# Altium project MS1-SEQ.PrjPcb (part 3 of 3)

## Sheet SensorSheet.SchDoc
size A; SheetNumber: 3; SheetTotal: 6
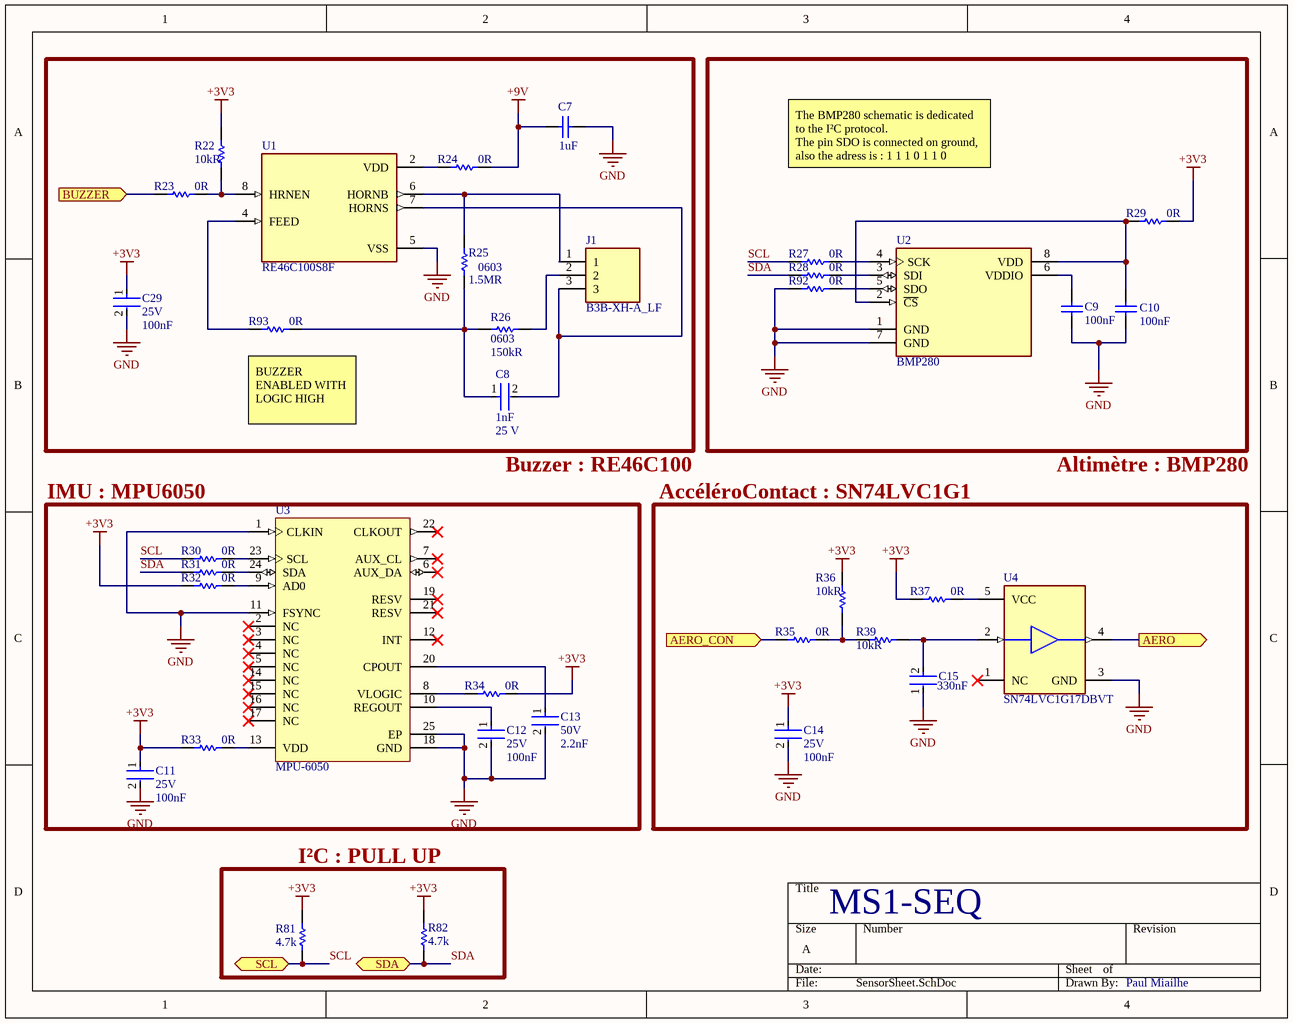
[diagram p5: SensorSheet.SchDoc]

### Parts
C7  Capacitance: 1uF  [CAPC1608X90X35LL10T15]  (hidden comment: GRM188R61E105KA12D)
C8  Capacitance: 1nF  Voltage Rating: 25 V  [FP-C0603C-CF-MFG]  (hidden comment: C0603C102J3GACTU)
C9  100nF  [SAMS-C0603-2_M]
C10  100nF  [SAMS-C0603-2_M]
C11  Voltage Rating (DC): 25V  Capacitance: 100nF  [FP-CGA3E-0_3-0_1-MFG]  (hidden comment: CGA3E2X7R1E104K080AA)
C12  Voltage Rating (DC): 25V  Capacitance: 100nF  [FP-CGA3E-0_3-0_1-MFG]  (hidden comment: CGA3E2X7R1E104K080AA)
C13  Voltage: 50V  Capacitance: 2.2nF  [FP-GRM188-0_1-e0_2_0_5-MFG]  (hidden comment: GRM1885C1H222JA01D)
C14  Voltage Rating (DC): 25V  Capacitance: 100nF  [FP-CGA3E-0_3-0_1-MFG]  (hidden comment: CGA3E2X7R1E104K080AA)
C15  Capacitance: 330nF  [FP-C1608-080-0_1-IPC_B]  (hidden comment: C1608X7R1H334K080AC)
C29  Voltage Rating (DC): 25V  Capacitance: 100nF  [FP-CGA3E-0_3-0_1-MFG]  (hidden comment: CGA3E2X7R1E104K080AA)
J1  B3B-XH-A_LF  [B3BXHALFSN]
R22  Resistance: 10kR  [RESC1609X55X30LL15T15]  (hidden comment: ERJ3EKF1002V)
R23  0R  [RESC1608X55X25ML10T15]
R24  0R  [RESC1608X55X25ML10T15]
R25  Case Code (Imperial): 0603  Resistance: 1.5MR  [RESC1608X55X30ML15T15]  (hidden comment: ERJ-3GEYJ155V)
R26  Case Code (Imperial): 0603  Resistance: 150kR  [RESC1608X55X30NL15T15]  (hidden comment: ERJ-3EKF1503V)
R27  0R  [RESC1608X55X25ML10T15]
R28  0R  [RESC1608X55X25ML10T15]
R29  0R  [RESC1608X55X25ML10T15]
R30  0R  [RESC1608X55X25ML10T15]
R31  0R  [RESC1608X55X25ML10T15]
R32  0R  [RESC1608X55X25ML10T15]
R33  0R  [RESC1608X55X25ML10T15]
R34  0R  [RESC1608X55X25ML10T15]
R35  0R  [RESC1608X55X25ML10T15]
R36  Resistance: 10kR  [RESC1609X55X30LL15T15]  (hidden comment: ERJ3EKF1002V)
R37  0R  [RESC1608X55X25ML10T15]
R39  Resistance: 10kR  [RESC1609X55X30LL15T15]  (hidden comment: ERJ3EKF1002V)
R81  Resistance: 4.7k  [RESC1608X55X25LL10T15]  (hidden comment: RC0603FR-074K7L)
R82  Resistance: 4.7k  [RESC1608X55X25LL10T15]  (hidden comment: RC0603FR-074K7L)
R92  0R  [RESC1608X55X25ML10T15]
R93  0R  [RESC1608X55X25ML10T15]
U1  RE46C100S8F  [SOIC127P600X175-8N]
U2  BMP280  [FP-BMP280-MFG]
U3  MPU-6050  [IS-QFN-24_V]
U4  SN74LVC1G17DBVT  [FP-DBV0005A-MFG]

### Blocks framed on the sheet
IMU : MPU6050: C11-C13 R30-R34 U3
AccéléroContact : SN74LVC1G1: C14 C15 R35-R37 R39 U4
I²C : PULL UP: R81 R82

### Ports
AERO (out), AERO_CON (in), BUZZER (in), SCL (bidir), SDA (bidir)

### Nets
+3V3: C11.1 C14.1 C29.1 R22.2 R29.2 R32.1 R33.1 R34.2 R36.2 R37.1 R81.2 R82.2
+9V: C7.1 R24.2
GND: C7.2 C9.1 C10.1 C11.2 C12.2 C13.2 C14.2 C15.1 C29.2 R92.1 U1.5(VSS) U2.1(GND) U2.7(GND) U3.1(CLKIN) U3.11(FSYNC) U3.18(GND) U3.25(EP) U4.3(GND)
SCL: R27.1 R30.1 R81.1 ; port SCL
SDA: R28.1 R31.1 R82.1 ; port SDA
NetC8_1: C8.1 R25.1 R26.1 R93.2
NetC8_2: C8.2 J1.3 U1.7(HORNS)
NetC9_2: C9.2 U2.6(VDDIO)
NetC10_2: C10.2 R29.1 U2.2(~{CS}) U2.8(VDD)
NetC12_1: C12.1 U3.10(REGOUT)
NetC13_1: C13.1 U3.20(CPOUT)
NetC15_2: C15.2 R39.1 U4.2(A)
NetJ1_1: J1.1 R25.2 U1.6(HORNB)
NetJ1_2: J1.2 R26.2
NetJ8_2: R35.1 ; port AERO_CON
NetJ101_27: R23.1 ; port BUZZER
NetJ101_31: U4.4(Y) ; port AERO
NetR22_1: R22.1 R23.2 U1.8(HRNEN)
NetR24_1: R24.1 U1.2(VDD)
NetR27_2: R27.2 U2.4(SCK)
NetR28_2: R28.2 U2.3(SDI)
NetR30_2: R30.2 U3.23(SCL)
NetR31_2: R31.2 U3.24(SDA)
NetR32_2: R32.2 U3.9(AD0)
NetR33_2: R33.2 U3.13(VDD)
NetR34_1: R34.1 U3.8(VLOGIC)
NetR35_2: R35.2 R36.1 R39.2
NetR37_2: R37.2 U4.5(VCC)
NetR92_2: R92.2 U2.5(SDO)
NetR93_1: R93.1 U1.4(FEED)

Not connected (* = marked no-connect by the designer): U3 2(NC)* 3(NC)* 4(NC)* 5(NC)* 6(AUX_DA)* 7(AUX_CL)* 12(INT)* 14(NC)* 15(NC)* 16(NC)* 17(NC)* 19(RESV)* 21(RESV)* 22(CLKOUT)*; U4 1(NC)*

### Notes on the sheet
- The BMP280 schematic is dedicated to the I²C protocol.
  The pin SDO is connected on ground, also the adress is : 1 1 1 0 1 1 0
- (near R93) BUZZER ENABLED WITH LOGIC HIGH
- Buzzer : RE46C100
- Altimètre : BMP280
- MS1-SEQ
- Paul Miailhe

### Library data of the parts
C7 = CMP-2006-02459-1: Manufacturer: Murata; Material: Ceramic; Tolerance: 10%; Voltage Rating: 25V; Dielectric: X5R; Part Number: GRM188R61E105KA12D; Supplier 1: Farnell; Supplier Part Number 1: 1828802; Manufacturer Part Number: GRM188R61E105KA12D; RoHS: Yes; Category: Ceramic Capacitors; Pricing 1: 10=0.13400, 100=0.05920, 500=0.03800, 1000=0.03090 (GBP); Mount: Surface Mount; Case/Package: 0603; Number of Pins: 2; Case Code (Metric): 1608; Case Code (Imperial): 0603; Min Operating Temperature: -55°C; Max Operating Temperature: 85°C; Packaging: Tape and Reel; Package Quantity: 4000; Voltage Rating (DC): 25V; Termination: SMD/SMT; Voltage: 25V; Length: 1.6mm; Width: 0.031inch; Height: 0.8mm; Depth: 0.8mm; Thickness: 0.035inch; Radiation Hardening: No; RoHS Compliant: Yes; REACH SVHC: No SVHC; Lead Free: Lead Free
C8 = CMP-2006-03010-2: CAP CER 1000PF 25V 5% NP0 0603; Manufacturer: KEMET; Value: 1,000 pF; Tolerance: 0.05; Temperature Characteristic: C0G; Temperature Coefficient: 30ppm/°C; Automotive Grade: Grade 1; Material: Ceramic; Category: Cap; Device Class L2: Capacitors; Octopart: https://octopart.com/c0603c102j3gactu-kemet-8375722; ComponentLink2URL: https://api.kemet.com/component-edge/download/datasheet/C0603C100J5GACAUTO.pdf; Digikey Description: CAP CER 1000PF 25V 5% NP0 0603; Device Class L3: Ceramic Capacitors; Temperature Range Low: -55°C; Automotive: Yes; RoHS: TRUE; Temperature Range High: +125°C; ComponentLink2Description: Datasheet; Mouser Description: Multilayer Ceramic Capacitors MLCC - SMD/SMT 25volts 1000pF C0G 5%; Lead Free: Yes; Height: 0.87mm; Temperature: -55°C to +125°C; Manufacturer Part Number: C0603C102J3GACTU; Device Class L1: Passive Components; Package: C0603C-CF; Supplier 1: Mouser; Supplier Part Number 1: 80-C0603C102J3G; Stock 1: 70048; Pricing 1: 1=0,10000, 10=0,02700, 50=0,02700, 100=0,02200, 500=0,01600, 1000=0,01200, 4000=0,01000, 8000=0,00900, 10000=0,00900 (USD); Mount: Surface Mount; Case/Package: 0603; Number of Pins: 2; Case Code (Imperial): 0603; Case Code (Metric): 1608; Dielectric Material: Ceramic; Contact Plating: Tin,Matte; Min Operating Temperature: -55°C; Max Operating Temperature: 125°C; Packaging: Tape and Reel; Package Quantity: 1; Voltage Rating (DC): 25V; Dielectric: C0G; Termination: SMD/SMT; Series: C; Construction: Flat; Voltage: 25V; Length: 1.6mm; Width: 0.031inch; Thickness: 0.034inch; Depth: 0.8mm; Lead Pitch: 0.7mm; Radiation Hardening: No; RoHS Compliant: Yes; REACH SVHC: No SVHC; ComponentLink1URL: https://datasheet.ciiva.com/18192/getdatasheetpartid-127803-18192629.pdf?src-supplier=Verical; ComponentLink1Description: https://datasheet.ciiva.com/18192/getdatasheetpartid-127803-18192629.pdf?src-supplier=Verical; ComponentLink3URL: https://datasheet.ciiva.com/7823/f9080b-0402-series-c0g-7823966.pdf?src-supplier=Element14; ComponentLink3Description: https://datasheet.ciiva.com/7823/f9080b-0402-series-c0g-7823966.pdf?src-supplier=Element14; ComponentLink4URL: https://datasheet.ciiva.com/7823/f9080b-0402-series-c0g-7823967.pdf?src-supplier=Element14; ComponentLink4Description: https://datasheet.ciiva.com/7823/f9080b-0402-series-c0g-7823967.pdf?src-supplier=Element14
C9 C10 = CMP-2000-05332-1: Multi-layer Ceramic Capacitor, -55 to 125 degC, 2-Pin SMD (0603), RoHS, Tape and Reel; Manufacturer: Samsung Electro-Mechanics; Capacitance: 0.1µF; Rated Voltage: 50V; Dielectric: X7R; Tolerance (%): ±10%; Case Size/Dimension: 0603; Datasheet URL: https://datasheet.ciiva.com/29198/456651-da-01-en-vs-kondensator-0605-29198839.pdf; Manufacturer URL: http://www.samsungsem.com/global/index.jsp; Datasheet Version: Nov-10
C11 C12 C14 C29 = CMP-08246-002186-1: Cap Ceramic 100nF 25V X7R 10% Pad SMD 0603 +125°C Automotive T/R; Manufacturer: TDK; Composition: Ceramic; Dielectric: X7R; Ratings: AEC-Q200; Length: 1.6mm; REACH SVHC: No SVHC; Width: 0.031inch; Packaging: Tape and Reel; Case/Package: 0603; Height: 0.8mm; Termination: SMD/SMT; Max Operating Temperature: 125°C; Thickness: 0.035inch; Case Code (Metric): 1608; Lead Free: Lead Free; Mount: Surface Mount; Voltage Rating: 25V; Tolerance: 10%; Weight: 7.1E-05oz; Min Operating Temperature: -55°C; Package Quantity: 1; Depth: 0.8mm; Case Code (Imperial): 0603; Supplier 1: Mouser; Supplier Part Number 1: 810-CGA3E2X7R1E104K; Manufacturer Part Number: CGA3E2X7R1E104K080AA; RoHS: Yes; Category: Ceramic Capacitors; Stock 1: 488891; Pricing 1: 1=0,12000, 10=0,05600, 50=0,05600, 100=0,02500, 1000=0,01400, 10000=0,01000 (USD); Series: CGA; Resistor Type: Ceramic; RoHS Compliant: Yes; ComponentLink1URL: https://datasheet.ciiva.com/24220/cga3e2x7r1e104k080aa-265934-24220022.pdf?src-supplier=Mouser; ComponentLink1Description: https://datasheet.ciiva.com/24220/cga3e2x7r1e104k080aa-265934-24220022.pdf?src-supplier=Mouser; ComponentLink2URL: https://datasheet.ciiva.com/22725/1735392-22725638.pdf?src-supplier=Element14; ComponentLink2Description: https://datasheet.ciiva.com/22725/1735392-22725638.pdf?src-supplier=Element14; ComponentLink3URL: https://datasheet.ciiva.com/22725/1735392-22725639.pdf?src-supplier=Element14; ComponentLink3Description: https://datasheet.ciiva.com/22725/1735392-22725639.pdf?src-supplier=Element14; ComponentLink4URL: https://datasheet.ciiva.com/16427/mlccspec-automotive-general-midvoltage-en-16427320.pdf?src-supplier=Future+Electronics; ComponentLink4Description: https://datasheet.ciiva.com/16427/mlccspec-automotive-general-midvoltage-en-16427320.pdf?src-supplier=Future+Electronics; ComponentLink5URL: https://datasheet.ciiva.com/23803/1735392-23803082.pdf?src-supplier=Newark; ComponentLink5Description: https://datasheet.ciiva.com/23803/1735392-23803082.pdf?src-supplier=Newark
C13 = CMP-06035-056041-1: Chip Multilayer Ceramic Capacitors for General Purpose, 0603, 2200pF, C0G, 30ppm/°C, 5%, 50V; Manufacturer: Murata; Insulation Resistance: 10GR; Min Operating Temperature: -55°C; Tolerance: 5%; Height: 0.8mm; Packaging: Tape and Reel; Length: 1.6mm; Mount: Surface Mount; Temperature Coefficient: 30ppm/°C; Case Code (Metric): 1608; Case/Package: 0603; Lead Free: Lead Free; Voltage Rating: 50V; Termination: SMD/SMT; Max Operating Temperature: 125°C; Voltage Rating (DC): 50V; Number of Pins: 2; Dielectric: C0G; Material: Ceramic; Thickness: 0.035inch; REACH SVHC: No SVHC; Dielectric Material: Ceramic; Case Code (Imperial): 0603; Radiation Hardening: No; Package Quantity: 1; Width: 0.8mm; Depth: 0.8mm; Supplier 1: Mouser; Supplier Part Number 1: 81-GRM1885C1H222JA01; Manufacturer Part Number: GRM1885C1H222JA01D; RoHS: Yes; Category: Ceramic Capacitors; Stock 1: 373748; Pricing 1: 1=0,19000, 10=0,08800, 50=0,08800, 100=0,03900, 500=0,02800, 1000=0,02200, 2000=0,02000, 4000=0,01800, 8000=0,01500, 10000=0,01500 (USD); Series: GRM; Construction: Flat; RoHS Compliant: Yes; ComponentLink1URL: https://datasheet.ciiva.com/3777/1632grm1885c1h222ja0123-3777835.pdf?src-supplier=Arrow+Electronics; ComponentLink1Description: https://datasheet.ciiva.com/3777/1632grm1885c1h222ja0123-3777835.pdf?src-supplier=Arrow+Electronics; ComponentLink2URL: https://datasheet.ciiva.com/11786/0900766b807a1cab-11786840.pdf?src-supplier=RSComponents; ComponentLink2Description: https://datasheet.ciiva.com/11786/0900766b807a1cab-11786840.pdf?src-supplier=RSComponents; ComponentLink3URL: https://datasheet.ciiva.com/133/partnumbering-e-01-133576.pdf?src-supplier=Digi-Key; ComponentLink3Description: https://datasheet.ciiva.com/133/partnumbering-e-01-133576.pdf?src-supplier=Digi-Key; ComponentLink4URL: https://datasheet.ciiva.com/133/partnumbering-e-01-133577.pdf?src-supplier=Digi-Key; ComponentLink4Description: https://datasheet.ciiva.com/133/partnumbering-e-01-133577.pdf?src-supplier=Digi-Key; ComponentLink5URL: https://datasheet.ciiva.com/133/partnumbering-e-01-133578.pdf?src-supplier=Digi-Key; ComponentLink5Description: https://datasheet.ciiva.com/133/partnumbering-e-01-133578.pdf?src-supplier=Digi-Key; ComponentLink6URL: https://datasheet.ciiva.com/6031/4360-6031797.pdf?src-supplier=Farnell; ComponentLink6Description: https://datasheet.ciiva.com/6031/4360-6031797.pdf?src-supplier=Farnell; ComponentLink7URL: https://datasheet.ciiva.com/11463/product-11463974.pdf?src-supplier=Avnet; ComponentLink7Description: https://datasheet.ciiva.com/11463/product-11463974.pdf?src-supplier=Avnet; ComponentLink8URL: https://datasheet.ciiva.com/2989/product-2989459.pdf?src-supplier=Avnet; ComponentLink8Description: https://datasheet.ciiva.com/2989/product-2989459.pdf?src-supplier=Avnet; ComponentLink9URL: https://datasheet.ciiva.com/16624/product-16624150.pdf?src-supplier=Avnet+Europe; ComponentLink9Description: https://datasheet.ciiva.com/16624/product-16624150.pdf?src-supplier=Avnet+Europe; ComponentLink10URL: https://datasheet.ciiva.com/7828/4360-7828918.pdf?src-supplier=Element14; ComponentLink10Description: https://datasheet.ciiva.com/7828/4360-7828918.pdf?src-supplier=Element14; ComponentLink11URL: https://datasheet.ciiva.com/7828/1747455-7828919.pdf?src-supplier=Element14; ComponentLink11Description: https://datasheet.ciiva.com/7828/1747455-7828919.pdf?src-supplier=Element14; ComponentLink12URL: https://datasheet.ciiva.com/7828/1747455-7828920.pdf?src-supplier=Element14; ComponentLink12Description: https://datasheet.ciiva.com/7828/1747455-7828920.pdf?src-supplier=Element14; ComponentLink13URL: https://datasheet.ciiva.com/29241/450664-da-01-en-vs-kondensator-0603-29241770.pdf?src-supplier=Conrad; ComponentLink13Description: https://datasheet.ciiva.com/29241/450664-da-01-en-vs-kondensator-0603-29241770.pdf?src-supplier=Conrad
C15 = CMP-2000-07551-2: Multilayer Ceramic Capacitors 330nF ±10% 50V X7R SMD 0603; Case Code (Imperial): 0603; Case Code (Metric): 1608; Dielectric: X7R; Length: 1.6mm; Construction: Flat; Resistor Type: Ceramic; Mount: Surface Mount; Voltage Rating: 50V; Packaging: Tape and Reel; Series: C; Case/Package: 0603; Lead Free: Lead Free; Tolerance: 10%; Voltage: 50V; REACH SVHC: No SVHC; Height: 0.8mm; Weight: 7.1E-05oz; Termination: SMD/SMT; Max Operating Temperature: 125°C; RoHS Compliant: Yes; Min Operating Temperature: -55°C; Depth: 0.8mm; Package Quantity: 1; Thickness: 0.037inch; Voltage Rating (DC): 50V; Dielectric Material: Ceramic; Width: 0.031inch
J1 = B3B-XH-A_LF__SN_: Connector; Manufacturer_Name: JST (JAPAN SOLDERLESS TERMINALS); Manufacturer_Part_Number: B3B-XH-A(LF)(SN); Datasheet Link: https://datasheet.lcsc.com/szlcsc/1812131720_JST-Sales-America-B3B-XH-A-LF-SN_C144394.pdf; Height: 7mm; Arrow Part Number: B3B-XH-A(LF)(SN); Arrow Price/Stock: https://www.arrow.com/en/products/b3b-xh-a-lf-sn/jst-manufacturing?region=europe
R22 R36 R39 = CMP-1012-00623-3: Chip Resistor, 10 KOhm, +/- 1%, 0.1 W, -55 to 155 degC, 0603 (1608 Metric), RoHS, Tape and Reel; Manufacturer: Panasonic; Manufacturer Part Number: ERJ-3EKF1002V; Voltage Rating: 75V; Case\/Package: 0603; Power Rating: 100mW; Temperature Coefficient: 100ppm\/degreesC; Number of Pins: 2; Package Reference: 603; Depth: 0.8mm; Mount: SurfaceMount; Package Description: 2-Pin Surface Mount Device, Body 1.6 x 0.85 mm; Datasheet Version: 02/2017; Length: 1.6mm; Lead Free: LeadFree; Height: 0.45mm; Number of Terminations: 2; Max Power Dissipation: 100mW; Min Operating Temperature: -55degC; Datasheet URL: https://industrial.panasonic.com/cdbs/www-data/pdf/RDA0000/AOA0000C304.pdf; Termination: SMD/SMT; Case Code (Metric): 1608; Tolerance: 1%; Max Operating Temperature: 155degC; RoHSCompliant: true; Voltage Rating (DC): 75V; Radiation Hardening: No; Packaging: TapeandReel; Composition: ThickFilm; Mounting Technology: SurfaceMount; Manufacturer URL: http://www.panasonic.com/; Width: 0.031inch; REACH SVHC: NoSVHC; Contact Plating: Tin; Military Standard: Not; Package Quantity: 1; Supplier 1: Mouser; Supplier Part Number 1: 667-ERJ-3EKF1002V; RoHS: Yes; Category: Chip SMD Resistors; Stock 1: 20455; Pricing 1: 1=0,10000, 10=0,04000, 50=0,04000, 100=0,01700, 1000=0,00700, 5000=0,00500, 10000=0,00500 (USD); Case/Package: 0603; Size Code: 0603; Resistor Type: Thick Film; Series: ERJ; Resistance Tolerance: 1%; Construction: Rectangular; Features: Automotive AEC-Q200; Technology: THICK FILM; RoHS Compliant: Yes; ComponentLink1URL: https://datasheet.ciiva.com/16511/aoa0000ce2-16511861.pdf?src-supplier=Avnet+Asia; ComponentLink1Description: https://datasheet.ciiva.com/16511/aoa0000ce2-16511861.pdf?src-supplier=Avnet+Asia; ComponentLink2URL: https://datasheet.ciiva.com/46372/1678782-46372725.pdf?src-supplier=Element14; ComponentLink2Description: https://datasheet.ciiva.com/46372/1678782-46372725.pdf?src-supplier=Element14; ComponentLink3URL: https://datasheet.ciiva.com/28514/426256-28514198.pdf?src-supplier=Element14; ComponentLink3Description: https://datasheet.ciiva.com/28514/426256-28514198.pdf?src-supplier=Element14; ComponentLink4URL: https://datasheet.ciiva.com/9194/aoa0000ce2-9194199.pdf?src-supplier=Avnet; ComponentLink4Description: https://datasheet.ciiva.com/9194/aoa0000ce2-9194199.pdf?src-supplier=Avnet; ComponentLink5URL: https://datasheet.ciiva.com/7830/aoa0000ce2-7830729.pdf?src-supplier=Element14; ComponentLink5Description: https://datasheet.ciiva.com/7830/aoa0000ce2-7830729.pdf?src-supplier=Element14; ComponentLink6URL: https://datasheet.ciiva.com/17212/aoa0000ce2-17212105.pdf?src-supplier=Avnet+Europe; ComponentLink6Description: https://datasheet.ciiva.com/17212/aoa0000ce2-17212105.pdf?src-supplier=Avnet+Europe; ComponentLink7URL: https://datasheet.ciiva.com/30208/aoa0000ce2-30208985.pdf?src-supplier=Onlinecomponents.com; ComponentLink7Description: https://datasheet.ciiva.com/30208/aoa0000ce2-30208985.pdf?src-supplier=Onlinecomponents.com; ComponentLink8URL: https://datasheet.ciiva.com/48530/aoa0000ce2-48530988.pdf?src-supplier=Avnet; ComponentLink8Description: https://datasheet.ciiva.com/48530/aoa0000ce2-48530988.pdf?src-supplier=Avnet; ComponentLink9URL: https://datasheet.ciiva.com/24070/aoa0000ce2-24070318.pdf?src-supplier=Mouser; ComponentLink9Description: https://datasheet.ciiva.com/24070/aoa0000ce2-24070318.pdf?src-supplier=Mouser; ComponentLink10URL: https://datasheet.ciiva.com/16759/70260748-16759807.pdf?src-supplier=Allied+Electronics; ComponentLink10Description: https://datasheet.ciiva.com/16759/70260748-16759807.pdf?src-supplier=Allied+Electronics
R23 R24 R27-R35 R37 R92 R93 = CMP-2100-03667-1: Chip Resistor, 0 Ohm, +/- 5%, 0.1 W, -55 to 155 degC, 0603 (1608 Metric), RoHS, Tape and Reel; Manufacturer: Yageo; Temperature Coefficient: 200ppm/degreesC; Voltage Rating: 50V; Power Rating: 100mW; Resistance: 0mOhm; Width: 0.8mm; Max Operating Temperature: 155degC; Tolerance: 5%; Package Reference: 0603; Height: 0.45mm; Depth: 0.8mm; Package Description: 2-Pin Surface Mount Device, Body 1.6 x 0.8 mm; Termination: SMD/SMT; Package Quantity: 5000; Case/Package: 0603; Case Code (Imperial): 0603; Radiation Hardening: No; Number of Pins: 2; Length: 1.6mm; Lead Free: LeadFree; Voltage Rating (DC): 50V; Military Standard: Not; Datasheet URL: http://www.yageo.com/NewPortal/yageodocoutput?fileName=/pdf/R-Chip/PYu-RC_Group_51_RoHS_L_5.pdf; Manufacturer URL: http://www.yageo.com/; Packaging: TapeandReel; Case Code (Metric): 1608; Min Operating Temperature: -55degC; Composition: ThickFilm; RoHSCompliant: true; Contact Plating: Tin; Datasheet Version: Rev. 5, 10/2016; REACH SVHC: NoSVHC
R25 = CMP-2000-00727-1: Manufacturer: Panasonic; Tolerance: 5%; Temperature Coefficient: 150ppm/°C; Max Power Dissipation: 100mW; Voltage Rating (DC): 50V; Voltage Rating: 75V; Part Number: ERJ-3GEYJ155V; Supplier 1: Mouser; Supplier Part Number 1: 667-ERJ-3GEYJ155V; Manufacturer Part Number: ERJ-3GEYJ155V; RoHS: Yes; Category: Chip SMD Resistors; Stock 1: 76730; Pricing 1: 1=0,10000, 10=0,03400, 50=0,03400, 100=0,01400, 1000=0,00700, 2500=0,00600, 5000=0,00400, 10000=0,00400 (USD); Mount: Surface Mount; Case/Package: 0603; Case Code (Metric): 1608; Contact Plating: Tin; Min Operating Temperature: -55°C; Max Operating Temperature: 155°C; Packaging: Tape and Reel; Resistor Type: Thick Film; Package Quantity: 1; Number of Terminations: 2; Features: Automotive AEC-Q200; Series: ERJ; Power Rating: 100mW; Termination: SMD/SMT; Resistance Tolerance: 5%; Construction: Rectangular; Technology: THICK FILM; Length: 1.6mm; Width: 0.031inch; Height: 0.45mm; Depth: 0.8mm; RoHS Compliant: Yes; Lead Free: Lead Free; Military Standard: Not; REACH SVHC: No SVHC; ComponentLink1URL: https://datasheet.ciiva.com/11821/0900766b80f806dd-11821430.pdf?src-supplier=RSComponents; ComponentLink1Description: https://datasheet.ciiva.com/11821/0900766b80f806dd-11821430.pdf?src-supplier=RSComponents; ComponentLink2URL: https://datasheet.ciiva.com/16780/70255313-16780680.pdf?src-supplier=Allied+Electronics; ComponentLink2Description: https://datasheet.ciiva.com/16780/70255313-16780680.pdf?src-supplier=Allied+Electronics; ComponentLink3URL: https://datasheet.ciiva.com/9198/aoa0000ce1-9198090.pdf?src-supplier=Avnet; ComponentLink3Description: https://datasheet.ciiva.com/9198/aoa0000ce1-9198090.pdf?src-supplier=Avnet; ComponentLink4URL: https://datasheet.ciiva.com/30248/4aoa0000ce1-30248779.pdf?src-supplier=Onlinecomponents.com; ComponentLink4Description: https://datasheet.ciiva.com/30248/4aoa0000ce1-30248779.pdf?src-supplier=Onlinecomponents.com; ComponentLink5URL: https://datasheet.ciiva.com/5959/1500035-5959709.pdf?src-supplier=Farnell; ComponentLink5Description: https://datasheet.ciiva.com/5959/1500035-5959709.pdf?src-supplier=Farnell; ComponentLink6URL: https://datasheet.ciiva.com/28658/1678796-28658445.pdf?src-supplier=Element14; ComponentLink6Description: https://datasheet.ciiva.com/28658/1678796-28658445.pdf?src-supplier=Element14; ComponentLink7URL: https://datasheet.ciiva.com/15828/aoa0000ce1-15828430.pdf?src-supplier=Onlinecomponents.com; ComponentLink7Description: https://datasheet.ciiva.com/15828/aoa0000ce1-15828430.pdf?src-supplier=Onlinecomponents.com
R26 = CMP-1012-00754-2: Manufacturer: Panasonic; Power Rating: 100mW; Tolerance: 1%; Voltage Rating: 75V; Temperature Coefficient: 100ppm/°C; Part Number: ERJ-3EKF1503V; Supplier 1: Mouser; Supplier Part Number 1: 667-ERJ-3EKF1503V; Manufacturer Part Number: ERJ-3EKF1503V; RoHS: Yes; Category: Chip SMD Resistors; Stock 1: 1123; Pricing 1: 1=0,10000, 10=0,03700, 50=0,03700, 100=0,01500, 1000=0,00800, 2500=0,00700, 5000=0,00600, 10000=0,00600 (USD); Mount: Surface Mount; Case/Package: 0603; Number of Pins: 2; Case Code (Metric): 1608; Contact Plating: Tin; Weight: 7.1E-05oz; Min Operating Temperature: -55°C; Max Operating Temperature: 155°C; Packaging: Tape and Reel; Package Quantity: 1; Termination: SMD/SMT; Max Power Dissipation: 100mW; Resistor Type: Thick Film; Number of Terminations: 2; Features: Automotive AEC-Q200; Series: ERJ; Resistance Tolerance: 1%; Voltage Rating (DC): 75V; Construction: Rectangular; Length: 1.6mm; Width: 0.8mm; Height: 0.022inch; Depth: 0.8mm; Radiation Hardening: No; Military Standard: Not; Lead Free: Lead Free; RoHS Compliant: Yes; REACH SVHC: No SVHC; ComponentLink1URL: https://datasheet.ciiva.com/6137/aoa0000ce2-6137485.pdf?src-supplier=Farnell; ComponentLink1Description: https://datasheet.ciiva.com/6137/aoa0000ce2-6137485.pdf?src-supplier=Farnell; ComponentLink2URL: https://datasheet.ciiva.com/7909/aoa0000ce2-7909193.pdf?src-supplier=Element14; ComponentLink2Description: https://datasheet.ciiva.com/7909/aoa0000ce2-7909193.pdf?src-supplier=Element14; ComponentLink3URL: https://datasheet.ciiva.com/7909/426256-7909546.pdf?src-supplier=Element14; ComponentLink3Description: https://datasheet.ciiva.com/7909/426256-7909546.pdf?src-supplier=Element14; ComponentLink4URL: https://datasheet.ciiva.com/22687/1678782-22687434.pdf?src-supplier=Element14; ComponentLink4Description: https://datasheet.ciiva.com/22687/1678782-22687434.pdf?src-supplier=Element14; ComponentLink5URL: https://datasheet.ciiva.com/46420/1678782-46420173.pdf?src-supplier=Element14; ComponentLink5Description: https://datasheet.ciiva.com/46420/1678782-46420173.pdf?src-supplier=Element14; ComponentLink6URL: https://datasheet.ciiva.com/16787/70260748-16787015.pdf?src-supplier=Allied+Electronics; ComponentLink6Description: https://datasheet.ciiva.com/16787/70260748-16787015.pdf?src-supplier=Allied+Electronics; ComponentLink7URL: https://datasheet.ciiva.com/9185/aoa0000ce2-9185494.pdf?src-supplier=Avnet; ComponentLink7Description: https://datasheet.ciiva.com/9185/aoa0000ce2-9185494.pdf?src-supplier=Avnet; ComponentLink8URL: https://datasheet.ciiva.com/48530/aoa0000ce2-48530984.pdf?src-supplier=Avnet; ComponentLink8Description: https://datasheet.ciiva.com/48530/aoa0000ce2-48530984.pdf?src-supplier=Avnet; ComponentLink9URL: https://datasheet.ciiva.com/30145/aoa0000ce2-30145242.pdf?src-supplier=Onlinecomponents.com; ComponentLink9Description: https://datasheet.ciiva.com/30145/aoa0000ce2-30145242.pdf?src-supplier=Onlinecomponents.com; ComponentLink10URL: https://datasheet.ciiva.com/17207/aoa0000ce2-17207477.pdf?src-supplier=Avnet+Europe; ComponentLink10Description: https://datasheet.ciiva.com/17207/aoa0000ce2-17207477.pdf?src-supplier=Avnet+Europe
R81 R82 = CMP-2000-06942-1: Chip Resistor, 4.7 KOhm, +/- 1%, 0.1 W, -55 to 155 degC, 0603 (1608 Metric), RoHS, Tape and Reel; Manufacturer: Yageo; Power Rating: 100mW; Temperature Coefficient: 100PPM/C; Voltage Rating: 50V; Package Reference: 0603; Series: RC; Datasheet Version: Rev. 7, 05/2017; Packaging: Reel; Termination Style: SMD/SMT; Datasheet URL: http://www.yageo.com/documents/recent/PYu-RC_Group_51_RoHS_L_7.pdf; Manufacturer URL: http://www.yageo.com/; Package Description: 2-Pin Surface Mount Device, Body 1.6 x 0.8 mm; Case Code - mm: 1608; Mounting Technology: SurfaceMount; Operating Temperature Range: -55Cto+155C; Tolerance: 1%; Product: ThickFilmResistorsGeneralPurpose; Supplier 1: Mouser; Supplier Part Number 1: 603-RC0603FR-074K7L; Manufacturer Part Number: RC0603FR-074K7L; RoHS: Yes; Category: Chip SMD Resistors; Stock 1: 772810; Pricing 1: 1=0,10000, 10=0,02400, 50=0,02400, 100=0,01000, 1000=0,00400, 5000=0,00300, 10000=0,00300 (USD); Case/Package: 0603; Number of Pins: 2; Case Code (Imperial): 0603; Case Code (Metric): 1608; Size Code: 0603; Min Operating Temperature: -55°C; Max Operating Temperature: 155°C; Voltage Rating (DC): 50V; Termination: SMD/SMT; Resistor Type: Thick Film; Features: Moisture Resistant; Max Power Dissipation: 100mW; Number of Terminations: 2; Construction: Rectangular; Resistance Tolerance: 1%; Length: 1.6mm; Width: 0.8mm; Height: 0.45mm; Depth: 0.8mm; Lead Pitch: 0.3mm; REACH SVHC: No SVHC; Military Standard: Not; Lead Free: Lead Free; RoHS Compliant: Yes; ComponentLink1URL: https://datasheet.ciiva.com/15189/getdatasheetpartid-422754-15189760.pdf?src-supplier=Verical; ComponentLink1Description: https://datasheet.ciiva.com/15189/getdatasheetpartid-422754-15189760.pdf?src-supplier=Verical; ComponentLink2URL: https://datasheet.ciiva.com/22747/443971-22747528.pdf?src-supplier=Element14; ComponentLink2Description: https://datasheet.ciiva.com/22747/443971-22747528.pdf?src-supplier=Element14; ComponentLink3URL: https://datasheet.ciiva.com/7660/38590-7660794.pdf?src-supplier=Element14; ComponentLink3Description: https://datasheet.ciiva.com/7660/38590-7660794.pdf?src-supplier=Element14; ComponentLink4URL: https://datasheet.ciiva.com/7746/1868787-7746365.pdf?src-supplier=Element14; ComponentLink4Description: https://datasheet.ciiva.com/7746/1868787-7746365.pdf?src-supplier=Element14; ComponentLink5URL: https://datasheet.ciiva.com/46440/1868787-46440909.pdf?src-supplier=Element14; ComponentLink5Description: https://datasheet.ciiva.com/46440/1868787-46440909.pdf?src-supplier=Element14; ComponentLink6URL: https://datasheet.ciiva.com/7746/1738695-7746366.pdf?src-supplier=Element14; ComponentLink6Description: https://datasheet.ciiva.com/7746/1738695-7746366.pdf?src-supplier=Element14
U1 = RE46C100S8F: MF: {'manufacturer': u'Microchip Technology'}; Value: *; Package: None; MP: RE46C100S8F; Price: None; Availability: Unavailable
U2 = CMP-2000-05076-3: SENSOR PRESSURE ABS; Operating Pressure: 15.95PSI; Pressure Type: Absolute; Output Type: SPI; Max Pressure: 290.08PSI; Port Style: No Port; Case/Package: SMD/SMT; Lead Free: Lead Free; Termination: SMD/SMT; Min Operating Temperature: -40°C; Number of Pins: 8; Max Operating Temperature: 85°C
U3 = CMP-1753-00002-2: 3-Axis Gyroscope, Accelerometer and a Digital Motion Processor(TM) (DMP), 2.375 to 3.46 V, -40 to 85 degC, 24-Pin QFN, RoHS, Tape and Reel; Manufacturer: InvenSense; Featured Product: MPU-60506-Axis,IntegratedI²CSolution; Other Names: 1428-1007-2 / MPU6050; Sensor Type: MotionTracking; Online Catalog: MPU-6000™Series; Unit PriceUSD: Digital; Datasheet Version: Rev. 3.3, 05/2012; Category: Sensors,Transducers; Datasheet URL: http://datasheet.octopart.com/MPU-6050-InvenSense-datasheet-14421344.pdf; Family: Multifunction; Standard Package: 5,000; Manufacturer URL: http://www.invensense.com/; Output Type: Digital; Dynamic Catalog: MPU-6000™Series
U4 = CMP-0859-00041-5: IC BUF NON-INVERT 5.5V SOT23-5; Manufacturer: Texas Instruments; Number Of Circuits: 1; Logic Function Desc: Non-Inverting; Standoff Height: 0mm; Propagation Delay: 4.6ns; Min Supply Voltage: 1.65V; Nominal Supply Current: 10uA; Category: IC; Height: 1.45mm; Manufacturer Part Number: SN74LVC1G17DBVT; Temperature Range High: +125°C; Device Class L2: Logic ICs; Temperature: -40°C to +125°C; Temperature Range Low: -40°C; Device Class L3: Buffers; Package: DBV0005A; Max Supply Voltage: 5.5V; Ambient Temperature Range High: +125°C; Number Of Outputs: 1; Device Class L1: Integrated Circuits (ICs); ComponentLink2URL: http://www.ti.com/lit/ds/symlink/sn74lvc1g17.pdf; Octopart: https://octopart.com/sn74lvc1g17dbvt-texas+instruments-2326350; Number Of Inputs: 1; Ambient Temperature Range Low: -40°C; ComponentLink2Description: Datasheet; Digikey Description: IC BUF NON-INVERT 5.5V SOT23-5; Lead Free: Yes; Automotive: No; RoHS: TRUE; Mouser Description: Buffers & Line Drivers SNGL Schmitt Trigger Buffer

## Nets that join several sheets
+3V3: MotorSheet (7 pins), PowerSheet (DS4.1 DS5.1 DS6.1), NucleoSheet (C28.1 J101.16 P10.9), GPIOSheet (10 pins), SensorSheet (12 pins)
+9V: PowerSheet (Q1.3 R63.1 R64.2), NucleoSheet (J101.24), SensorSheet (C7.1 R24.2)
+9V_PAYLOAD: MotorSheet (7 pins), PowerSheet (Q3.3 R71.1 R72.2)
+9V_REC: MotorSheet (14 pins), PowerSheet (Q2.3 R67.1 R68.2)
GND: MainSheet (12 pins), MotorSheet (36 pins), PowerSheet (12 pins), NucleoSheet (9 pins), GPIOSheet (12 pins), SensorSheet (18 pins)
NetC25_2: PowerSheet (C25.2 R64.1 R65.2), NucleoSheet (J101.28)
NetC26_2: PowerSheet (C26.2 R68.1 R69.2), NucleoSheet (J101.30)
NetC27_2: PowerSheet (C27.2 R72.1 R73.2), NucleoSheet (J102.35)
NetF1_1: MainSheet (J5.1), PowerSheet (F1.1)
NetF2_1: MainSheet (J6.1), PowerSheet (F2.1)
NetF3_1: MainSheet (J7.1), PowerSheet (F3.1)
NetJ8_2: MainSheet (J8.2), SensorSheet (R35.1)
NetJ9_2: MainSheet (J9.2), GPIOSheet (R40.1 R44.2)
NetJ10_2: MainSheet (J10.2), GPIOSheet (R41.1 R45.2)
NetJ11_2: MainSheet (J11.2), GPIOSheet (R42.1 R46.2)
NetJ12_2: MainSheet (J12.2), GPIOSheet (R43.1 R47.2)
NetJ13_2: MainSheet (J13.2), GPIOSheet (R48.1 R52.2)
NetJ14_2: MainSheet (J14.2), GPIOSheet (R49.1 R53.2)
NetJ15_2: MainSheet (J15.2), GPIOSheet (R50.1 R94.2)
NetJ16_2: MainSheet (J16.2), GPIOSheet (R51.1 R95.2)
NetJ101_1: MotorSheet (R86.1), NucleoSheet (J101.1)
NetJ101_2: MotorSheet (R87.1), NucleoSheet (J101.2)
NetJ101_13: NucleoSheet (J101.13), GPIOSheet (R60.2)
NetJ101_15: NucleoSheet (J101.15), GPIOSheet (R61.2)
NetJ101_17: MotorSheet (R88.1), NucleoSheet (J101.17)
NetJ101_27: NucleoSheet (J101.27), SensorSheet (R23.1)
NetJ101_31: NucleoSheet (J101.31), SensorSheet (U4.4)
NetJ101_32: NucleoSheet (J101.32), GPIOSheet (R58.2)
NetJ101_34: MotorSheet (R15.1 R18.1), NucleoSheet (J101.34)
NetJ101_35: PowerSheet (R75.2), NucleoSheet (J101.35)
NetJ101_36: PowerSheet (R74.2), NucleoSheet (J101.36)
NetJ101_37: PowerSheet (R76.2), NucleoSheet (J101.37)
NetJ102_1: MotorSheet (R5.1 R98.2), NucleoSheet (J102.1)
NetJ102_2: MotorSheet (R2.1 R7.1), NucleoSheet (J102.2)
NetJ102_4: MotorSheet (R12.1 R100.2), NucleoSheet (J102.4)
NetJ102_6: MotorSheet (R16.1 R20.1), NucleoSheet (J102.6)
NetJ102_11: NucleoSheet (J102.11), GPIOSheet (R57.2)
NetJ102_13: NucleoSheet (J102.13), GPIOSheet (R56.2)
NetJ102_15: NucleoSheet (J102.15), GPIOSheet (R55.2)
NetJ102_16: MotorSheet (R9.1 R13.1), NucleoSheet (J102.16)
NetJ102_19: MotorSheet (R4.1 R6.1), NucleoSheet (J102.19)
NetJ102_21: MotorSheet (R3.1 R97.2), NucleoSheet (J102.21)
NetJ102_22: MotorSheet (R17.1 R102.2), NucleoSheet (J102.22)
NetJ102_23: MotorSheet (R1.1 R96.2), NucleoSheet (J102.23)
NetJ102_24: MotorSheet (R21.1 R104.2), NucleoSheet (J102.24)
NetJ102_25: MotorSheet (R19.1 R103.2), NucleoSheet (J102.25)
NetJ102_26: MotorSheet (R10.1 R99.2), NucleoSheet (J102.26)
NetJ102_28: MotorSheet (R14.1 R101.2), NucleoSheet (J102.28)
NetJ102_30: MotorSheet (R8.1 R11.1), NucleoSheet (J102.30)
NetJ102_34: NucleoSheet (J102.34), GPIOSheet (R54.2)
NetJ102_37: NucleoSheet (J102.37), GPIOSheet (R59.2)
OUTA_M1: MainSheet (J2.1), MotorSheet (6 pins)
OUTA_M2: MainSheet (J3.1), MotorSheet (6 pins)
OUTA_M3: MainSheet (J4.1), MotorSheet (6 pins)
OUTB_M1: MainSheet (J2.2), MotorSheet (5 pins)
OUTB_M2: MainSheet (J3.2), MotorSheet (5 pins)
OUTB_M3: MainSheet (J4.2), MotorSheet (5 pins)
SCL: NucleoSheet (J102.3), SensorSheet (R27.1 R30.1 R81.1)
SDA: NucleoSheet (J102.5), SensorSheet (R28.1 R31.1 R82.1)